# EAGLE design LM1117 Variable Regulator(1.25VDC-10VDC) (EAGLE 9.6.2)
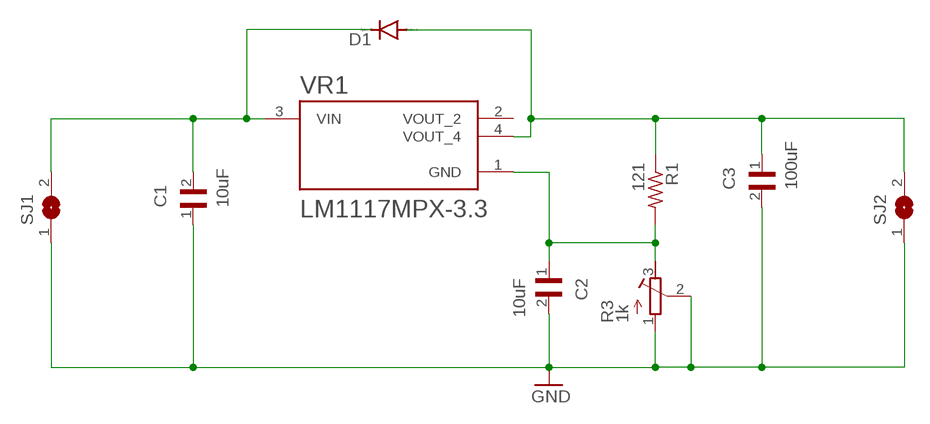
[diagram p0: schematic, sheet 1]

## Parts
C1  10uF  GRM188C81C106MA73J  [CAPC1608X100N]
C2  10uF  GRM188C81C106MA73J  [CAPC1608X100N]
C3  100uF  293D107X9016D2TE3  [CAPPM7343X310N]
D1  DIODE-DO-214AC  [DO-214AC]
R1  121  R-US_R1206  [R1206]
R3  1k  R-TRIMM3214W  [RTRIM3214W]
SJ1  SJW  [SJW]
SJ2  SJW  [SJW]
VR1  LM1117MPX-3.3  [VREG_LM1117MPX-3.3]

## Nets
GND: C1.1 C2.2 C3.2 R3.1(A) R3.2(S) SJ1.1 SJ2.1
N$1: C1.2 D1.C SJ1.2 VR1.3(VIN)
N$3: C3.1 D1.A R1.1 SJ2.2 VR1.4(VOUT_4)
N$4: C2.1 R1.2 R3.3(E) VR1.1(GND)
Unconnected: VR1.2(VOUT_2)

## Library data of the parts
C1 C2 = Capacitor_10uF_smd_CAP-0135:GRM188C81C106MA73J: Cap Ceramic 10uF 16V X6S 20% Pad SMD 0603 105°C T/R Check prices <https://pricing.snapeda.com/search/part/GRM188C81C106MA73J/?ref=eda>; AVAILABILITY: Warning; DESCRIPTION: 10µF ±20% 16V Ceramic Capacitor X6S 0603 (1608 Metric); MF: Murata; MP: GRM188C81C106MA73J; PACKAGE: 1608 Murata; PRICE: None; PURCHASE-URL: https://pricing.snapeda.com/search/part/GRM188C81C106MA73J/?ref=eda
C3 = Capacitor_100uF_smd_CAP-3131:293D107X9016D2TE3: Capacitor: tantalum; 100uF; 16VDC; SMD; Case: D; ±10%; -55÷125°C Check prices <https://pricing.snapeda.com/search/part/293D107X9016D2TE3/?ref=eda>; AVAILABILITY: Warning; DESCRIPTION: 100µF Molded Tantalum Capacitors 16V 2917 (7343 Metric) 600mOhm; MF: Vishay Sprague; MP: 293D107X9016D2TE3; PACKAGE: 2917 Vishay; PRICE: None; PURCHASE-URL: https://pricing.snapeda.com/search/part/293D107X9016D2TE3/?ref=eda
D1 = diode:DIODE-: DIODE
R1 = rcl:R-US_: RESISTOR, American symbol; SPICEPREFIX: R
R3 = rcl:R-TRIMM: Trimm resistor; SPICEMODEL: X; SPICEPREFIXL: POT
SJ1 SJ2 = jumper:SJ: SMD solder JUMPER
VR1 = LM1117MPX-3.3:LM1117MPX-3.3: 800-mA 15-V linear voltage regulator 4-SOT-223 0 to 125 Check prices <https://pricing.snapeda.com/search/part/LM1117MPX-3.3/?ref=eda>; AVAILABILITY: Warning; DESCRIPTION: 800-mA 15-V linear voltage regulator 4-SOT-223; MF: Texas Instruments; MP: LM1117MPX-3.3; PACKAGE: SOT-223-4 Texas Instruments; PRICE: None; PURCHASE-URL: https://pricing.snapeda.com/search/part/LM1117MPX-3.3/?ref=eda

## Board
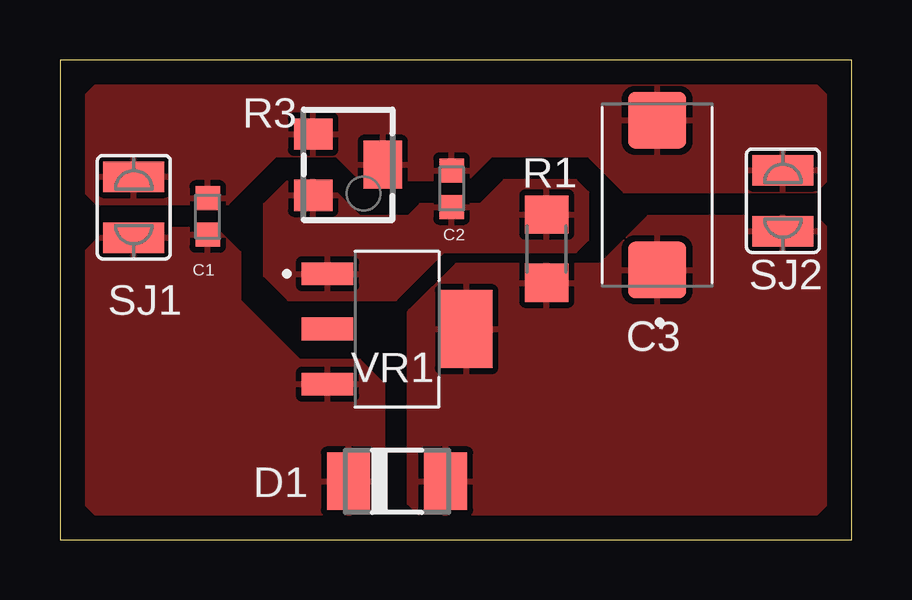
[diagram p1: board, top side]

Size 33 x 20 mm. Coordinates in mm from the lower left corner, seen from the top.
Outline: 0,0 33,0 33,20 0,20 0,0
Copper layers (1*16): Top 0.035mm / dielectric 1.5mm / Bottom 0.035mm
Design rules "default": minimum track width 6mil, minimum drill 0.35mm, track to track 6mil, track to pad 6mil, pad to pad 6mil, via to via 6mil, smd to smd 6mil, copper to edge 40mil, drill to drill 6mil, minimum pad ring 10mil, minimum via ring 8mil, stop-mask expansion 4mil, vias tented up to drill 0mil, thermal gap 10mil

### Footprints (pad centres in the part's own frame; a part is rotated, then mirrored left to right if it is on the bottom)
CAPC1608X100N = smd 1 x 1.02: 1 -0.759,0; 2 0.759,0
CAPPM7343X310N = smd 2.37 x 2.43: 1 -3.12,0; 2 3.12,0
DO-214AC = smd 1.8 x 2.4: A 2.025,0; C -2.025,0
R1206 = smd 1.6 x 1.803: 1 -1.422,0; 2 1.422,0
RTRIM3214W = smd 1.3 x 1.6: 1 -1.275,-1.45; 3 1.275,-1.45 | smd 2 x 1.6: 2 0,1.45
SJW = smd 1.27 x 2.54: 1 -1.27,0; 2 1.27,0
VREG_LM1117MPX-3.3 = smd 2.15 x 0.95: 1 -2.9,2.3; 2 -2.9,0; 3 -2.9,-2.3 | smd 2.15 x 3.25: 4 2.9,0

### Placement (x,y rotation side)
C1  6.16,13.47 270 top
C2  16.33,14.63 90 top
C3  24.9,14.36 90 top
D1  14.05,2.43 0 top
R1  20.29,12.13 90 top
R3  12.01,15.63 270 top
SJ1  3.08,13.86 270 top
SJ2  30.14,14.13 270 top
VR1  14.05,8.78 0 top

### Tracks (layer width: path | path; a pad name or v marks a point on that pad's centre or on a via)
GND
  pour Top: 31.5,14.5 23.5,14.5 22,16 18,16 17,15 12.5,15 11.5,16 9,16 7,14 1.5,14 1,14.5 1,18.5 2,19.5 31,19.5 32,18.5 32,15
N$1
  pour Top: 2,13 6.5,13 7.5,12 7.5,10 10,7.5 12.5,7.5 13.5,6.5 13.5,1.5 12.5,0.5 2,0.5 1,1.5 1,12
N$3
  pour Top: 14.5,9.5 14.5,9.45 14.5,1.5 15.5,0.5 31,0.5 32,1.5 32,13 31.5,13.5 24.5,13.5 22.5,11.5 16.5,11.5 14.6,9.6
N$4
  pour Top: 9.5,15 8.5,14 8.5,11 9.5,10 14,10 16,12 21.5,12 22,12.5 22,14.5 21.5,15 18.5,15 17.5,14 15,14 14.5,13.5 12.5,13.5 11,15